# EAGLE design maus-blenano2-mk-1.0.2 (EAGLE 7.5.0)
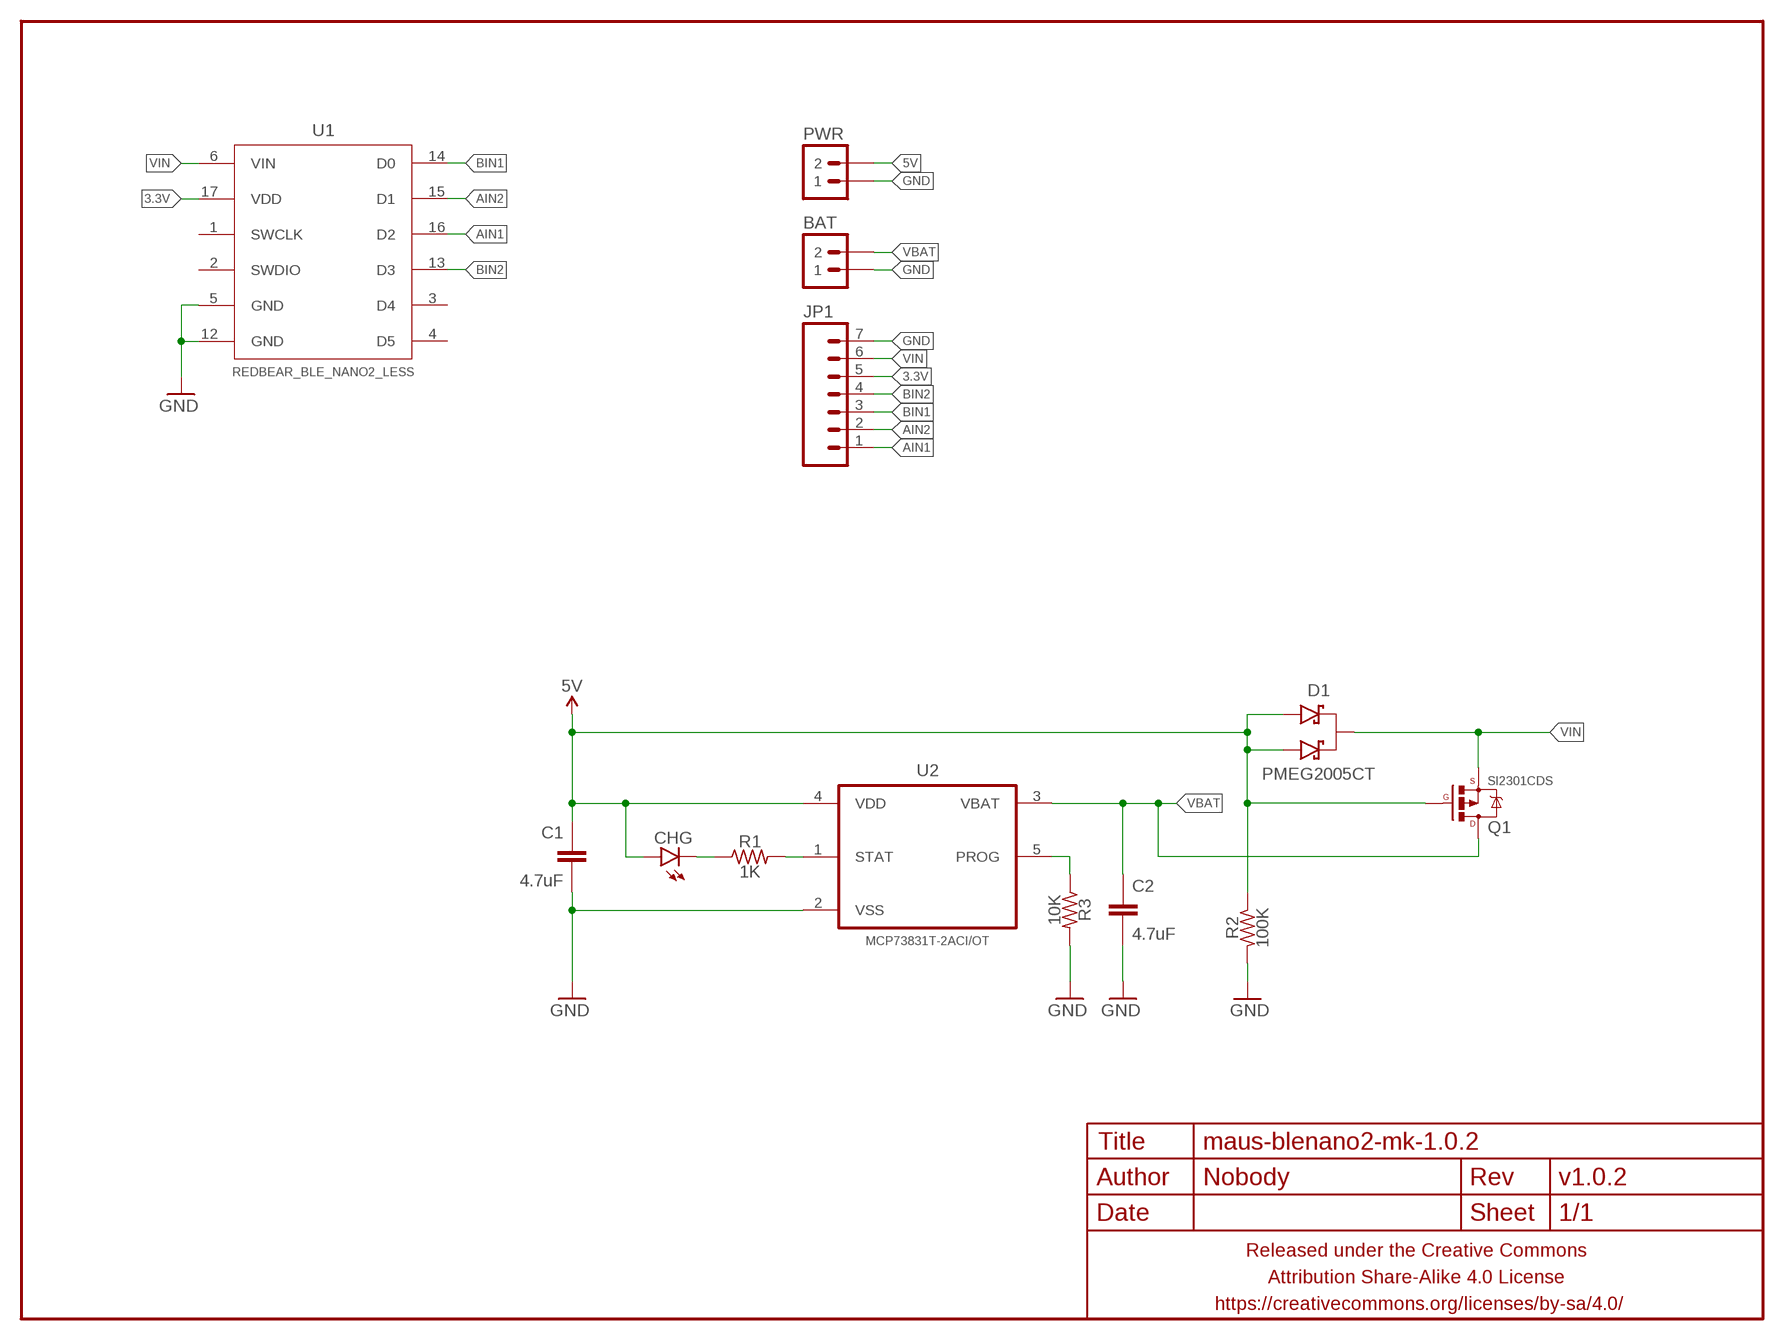
[diagram p0: schematic, sheet 1]

## Parts
BAT  M02JST-SH-RA  [JST-2-SH-RA]
C1  4.7uF  CAPACITOR-CERAMICC0603-TIGHTER  [C0603-TIGHTER]
C2  4.7uF  CAPACITOR-CERAMICC0603-TIGHTER  [C0603-TIGHTER]
CHG  LED0603-TIGHT  [LED-0603-TIGHT]
D1  PMEG2005CT  DIODE-SCHOTTKY-DUALPMEG2005CT  [SOT23]
FRAME1  FRAME-LETTERNO_PACKAGE  [DUMMY]
JP1  M07PTH-CENTERED  [1X07_CENTERED]
PWR  M02JST-SH-RA  [JST-2-SH-RA]
Q1  SI2301CDS  MOSFET-PCHANNELSOT-23  [SOT23]
R1  1K  RESISTORR0603-TIGHTER  [R0603-TIGHTER]
R2  100K  RESISTORR0603-TIGHTER  [R0603-TIGHTER]
R3  10K  RESISTORR0603-TIGHTER  [R0603-TIGHTER]
U1  REDBEAR_BLE_NANO2_LESS  [REDBEAR_BLE_NANO2_LESS]
U2  MCP73831T-2ACI/OT  [SOT95P280X145-5N]

## Nets
3.3V: JP1.5 U1.17(VDD)
5V: C1.1 CHG.A D1.1(A1) D1.2(A2) PWR.2 Q1.1(G) R2.1 U2.4(VDD)
AIN1: JP1.1 U1.16(D2)
AIN2: JP1.2 U1.15(D1)
BIN1: JP1.3 U1.14(D0)
BIN2: JP1.4 U1.13(D3)
GND: BAT.1 C1.2 C2.2 JP1.7 PWR.1 R2.2 R3.2 U1.5(GND) U1.12(GND) U2.2(VSS)
N$1: R1.2 U2.1(STAT)
N$2: CHG.C R1.1
N$11: R3.1 U2.5(PROG)
VBAT: BAT.2 C2.1 Q1.3(D) U2.3(VBAT)
VIN: D1.3(K) JP1.6 Q1.2(S) U1.6(VIN)
Unconnected: U1.1(SWCLK) U1.2(SWDIO) U1.3(D4) U1.4(D5)

## Library data of the parts
BAT PWR = a_parts:M02: Standard 2-pin 0.1" header. Use with - straight break away headers ( PRT-00116) - right angle break away headers (PRT-00553) - swiss pins (PRT-00743) - machine pins (PRT-00117) - female headers (PRT-00115) Molex polarized connector foot print use with: PRT-08233 with associated crimp pins and housings. 2.54_SCREWTERM for use with PRT-10571. 3.5mm Screw Terminal footprints for PRT-08084 5mm Screw Terminal footprints for use with PRT-08433
C1 C2 = a_parts:CAPACITOR-CERAMIC: CAPACITOR, European symbol
CHG = a_parts:LED: LEDs Standard schematic elements and footprints for 5mm, 3mm, 1206, and 0603 sized LEDs. 5mm - Spark Fun Electronics SKU : COM-00529 (and others)
D1 = a_parts:DIODE-SCHOTTKY-DUAL
FRAME1 = a_parts:FRAME-LETTER: Schematic Frame Standard 8.5x11 US Letter frame; DESIGNER: Nobody; VERSION: v1.0.2
JP1 = a_parts:M07: Header 7 Standard 7-pin 0.1" header. Use with straight break away headers (SKU : PRT-00116), right angle break away headers (PRT-00553), swiss pins (PRT-00743), machine pins (PRT-00117), and female headers (PRT-00115). NOTES ON THE VARIANTS LOCK and LOCK_LONGPADS... This footprint was designed to help hold the alignment of a through-hole component (i.e. 7-pin header) while soldering it into place. You may notice that each hole has been shifted either up or down by 0.005 of an inch from it's more standard position (which is usually a perfectly straight line). This slight alteration caused the pins (the squares in the middle) to touch the edges of the holes. Because they are alternating, it causes a "brace" to hold the header in place. 0.005 has proven to be the perfect amount of "off-center" position when using our standard breakaway headers. Although looks a little odd when you look at the bare footprint, once you have a header in there, the alteration is very hard to notice. Also, if you push a header all the way into place, it is covered up entirely on the bottom side. This idea of altering the position of holes to aid alignment will be further integrated into the Sparkfun Library for other footprints. It can help hold any component with 3 or more connection pins.
Q1 = a_parts:MOSFET-PCHANNEL: Generic PMOSFET IRLML2244 - TRANS-11153 (SOT-23 -20V -4.3A) (1.Gate 2.Source 3.Drain) FQP27P06 - COM-10349 <http://www.sparkfun.com/products/10349> (TO-220 -60V -27A) (1.Gate 2.Source 3.Drain)
R1-R3 = a_parts:RESISTOR: RESISTOR, American symbol
U1 = a_parts:REDBEAR_BLE_NANO2_LESS
U2 = a_parts:MCP73831T-2ACI/OT: Charge Management Controller; MPN: MCP73831T-2ACI/OT; OC_FARNELL: 1332158; OC_NEWARK: 56K7045; PACKAGE: SOT-5; SUPPLIER: Microchip

## Board
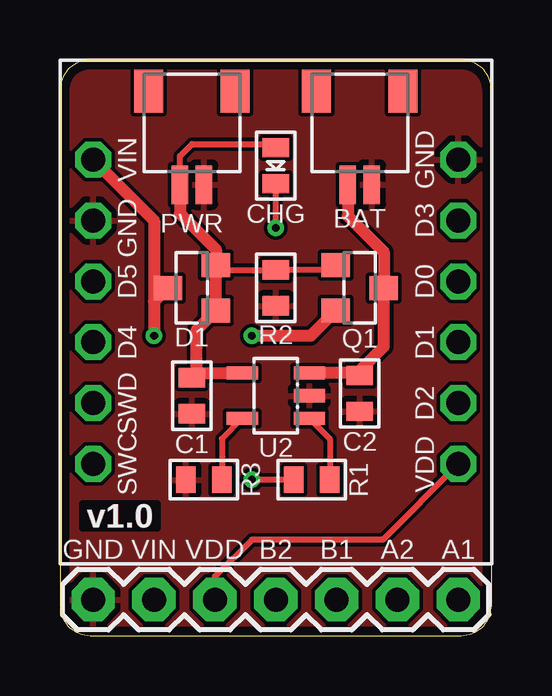
[diagram p1: board, top side]
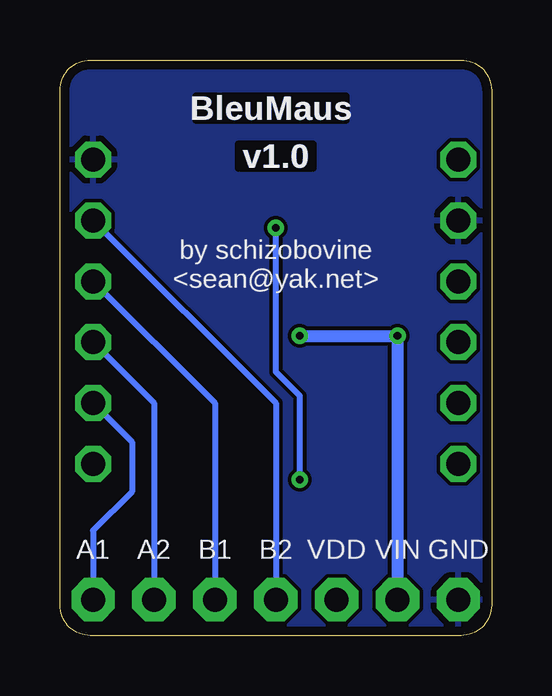
[diagram p2: board, bottom side, seen from below]

Size 18 x 24 mm. Coordinates in mm from the lower left corner, seen from the top.
Outline: 16.73,24 1.27,24 arc90 0,22.73 0,1.27 arc90 1.27,0 16.73,0 arc90 18,1.27 18,22.73 arc90 16.73,24
Copper layers (1*16): Top 0.0356mm / dielectric 1.5011mm / Bottom 0.0356mm
Design rules "LaenPCBOrder2": minimum track width 6mil, minimum drill 13mil, track to track 6mil, track to pad 6mil, pad to pad 6mil, via to via 6mil, smd to smd 6mil, copper to edge 15mil, drill to drill 6mil, minimum pad ring 7mil, minimum via ring 7mil, stop-mask expansion 3mil, vias tented up to drill 20mil, thermal gap 10mil

### Footprints (pad centres in the part's own frame; a part is rotated, then mirrored left to right if it is on the bottom)
JST-2-SH-RA = smd 0.7 x 1.6: 1 -0.5,4.8; 2 0.5,4.8 | smd 1.2 x 1.8: P$1 -1.8,0.9; P$2 1.8,0.9
C0603-TIGHTER = smd 0.8 x 1.1: 1 -0.75,0; 2 0.75,0
LED-0603-TIGHT = smd 0.8 x 1.1: A 0.75,0; C -0.75,0
SOT23 = smd 1 x 1.2: 1 -0.95,-1; 2 0.95,-1; 3 0,1
1X07_CENTERED = drill 1 pad 1.8 octagon: 1 -7.62,0; 2 -5.08,0; 3 -2.54,0; 4 0,0; 5 2.54,0; 6 5.08,0; 7 7.62,0
R0603-TIGHTER = smd 0.8 x 1.1: 1 -0.75,0; 2 0.75,0
REDBEAR_BLE_NANO2_LESS = drill 1 octagon: 1 7.62,6.35; 2 7.62,3.81; 3 7.62,1.27; 4 7.62,-1.27; 5 7.62,-3.81; 6 7.62,-6.35; 12 -7.62,-6.35; 13 -7.62,-3.81; 14 -7.62,-1.27; 15 -7.62,1.27; 16 -7.62,3.81; 17 -7.62,6.35
SOT95P280X145-5N = smd 1.3 x 0.55: 1 -1.4,0.95; 2 -1.4,0; 3 -1.4,-0.95; 4 1.4,-0.95; 5 1.4,0.95

### Placement (x,y rotation side)
BAT  12.5,23.6 180 top
C1  5.5,10 270 top
C2  12.5,10.1 270 top
CHG  9,19.6 90 top
D1  5.5,14.5 90 top
FRAME1  0,0 0 top
JP1  9,1.5 180 top
PWR  5.5,23.6 180 top
Q1  12.5,14.5 270 top
R1  10.5,6.5 0 top
R2  9,14.5 270 top
R3  6,6.5 180 top
U1  9,13.5 180 top
U2  9,10 180 top

### Tracks (layer width: path | path; a pad name or v marks a point on that pad's centre or on a via)
3.3V
  Top 0.254: U1.17 13.47,4 8,4 6.46,2.46 JP1.5
5V
  Top 0.254: Q1.1 11.3,15.25 R2.1 6.7,15.25 D1.2 | PWR.2 5,20 5.5,20.5 8.85,20.5 CHG.A
  Top 0.5: C1.1 5.7,10.95 | 5.7,10.95 U2.4 | 5.7,10.95 5.7,12.75 D1.1 D1.2 6.5,16.1 5,17.6 PWR.2
AIN1
  Bottom 0.254: U1.16 15,8.07 15,6 16.62,4.38 JP1.1
AIN2
  Bottom 0.254: U1.15 14.08,9.69 JP1.2
BIN1
  Bottom 0.254: U1.14 11.54,9.69 JP1.3
BIN2
  Bottom 0.254: U1.13 9,9.69 JP1.4
GND
  pour Top (rank 6): 0,24 0,0 18,0 18,24
  pour Bottom (rank 6): 0,24 0,0 18,0 18,24
N$1
  Top 0.254: U2.1 11.25,8.2 R1.2
N$2  (via drill 0.33)
  Top 0.254: R1.1 v8,6.5 | v9,17 CHG.C
  Bottom 0.254: v8,6.5 8,10 9,11 v9,17
N$11
  Top 0.254: U2.5 6.75,8.2 R3.1
VBAT
  Top 0.5: C2.1 12.4,10.95 | 12.4,10.95 U2.3 | 12.4,10.95 13.5,12.05 Q1.3 13.5,16 12,17.5 BAT.2
VIN  (via drill 0.33)
  Top 0.5: D1.3 3.92,13.92 | 3.92,13.92 v3.92,12.5 | U1.6 3.92,17.31 3.92,13.92 | Q1.2 10.45,12.5 v8,12.5
  Bottom 0.5: v8,12.5 v3.92,12.5 JP1.6

### Text on the board
Bottom: BleuMaus
tPlace: GND | VIN | VDD | B2 | B1 | A2 | A1
bPlace: BleuMaus | by schizobovine / <sean@yak.net> | GND | VIN | VDD | B2 | B1 | A2 | A1